# EAGLE design Smart ezNODE 503 guide lines (EAGLE 7.7.0)
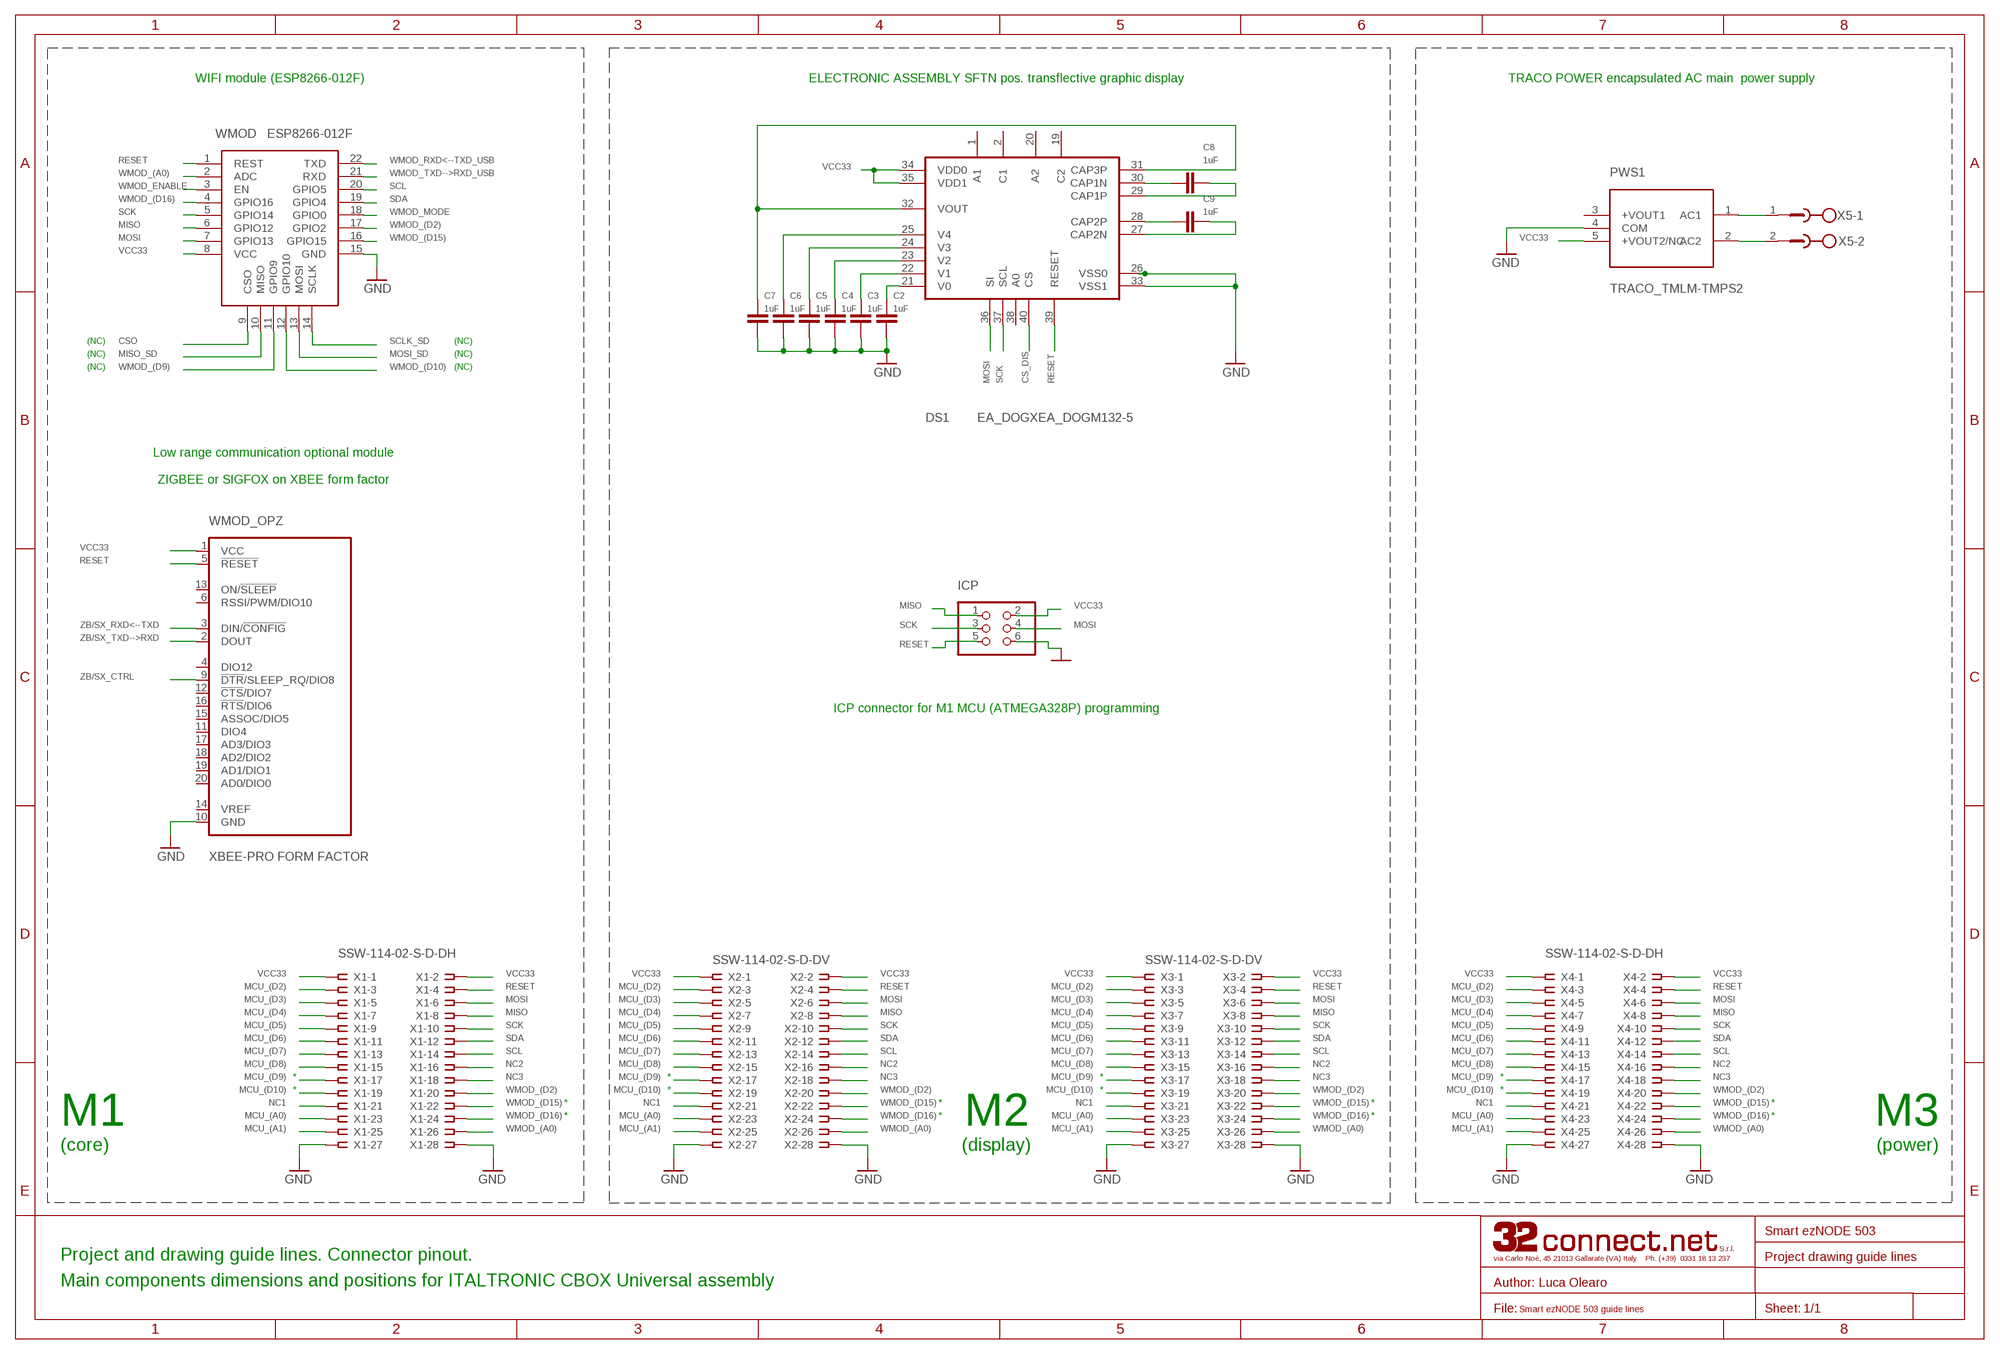
[diagram p0: schematic, sheet 1]

## Parts
C2  1uF  C-EUC0402  [C0402]
C3  1uF  C-EUC0402  [C0402]
C4  1uF  C-EUC0402  [C0402]
C5  1uF  C-EUC0402  [C0402]
C6  1uF  C-EUC0402  [C0402]
C7  1uF  C-EUC0402  [C0402]
C8  1uF  C-EUC0402  [C0402]
C9  1uF  C-EUC0402  [C0402]
DS1  EA_DOGXEA_DOGM132-5  [EA_DOGM]
ICP  PINHD-2X3/SMD  [2X3_SMD]
PWS1  TRACO_TMLM-TMPS2  [TRACO_TMPS03XXX]
WMOD  ESP8266-012F  ESP8266-12GPIO04/05_CORRECTED  [ESP8266-ESP12]
WMOD_OPZ  XBEE-PRO FORM FACTOR  XBEE-PRO  [XBEE-PRO]
X1  SSW-114-02-S-D-DH  [FTE-114-XX-G-DH]
X2  SSW-114-02-S-D-DV  [CLE-114-01-X-DV-A]
X3  SSW-114-02-S-D-DV  [CLE-114-01-X-DV-A]
X4  SSW-114-02-S-D-DH  [FTE-114-XX-G-DH]
X5  MSTBV2  [MSTBV2]

## Nets
CS_DIS: DS1.40(CS)
CSO: WMOD.9(CSO)
GND: C2.2 C3.2 C4.2 C5.2 C6.2 C7.2 DS1.26(VSS0) DS1.33(VSS1) ICP.6 PWS1.4(COM) WMOD.15(GND) WMOD_OPZ.10(GND) X1.27 X1.28 X2.27 X2.28 X3.27 X3.28 X4.27 X4.28
MCU_(A0): X1.23 X2.23 X3.23 X4.23
MCU_(A1): X1.25 X2.25 X3.25 X4.25
MCU_(D2): X1.3 X2.3 X3.3 X4.3
MCU_(D3): X1.5 X2.5 X3.5 X4.5
MCU_(D4): X1.7 X2.7 X3.7 X4.7
MCU_(D5): X1.9 X2.9 X3.9 X4.9
MCU_(D6): X1.11 X2.11 X3.11 X4.11
MCU_(D7): X1.13 X2.13 X3.13 X4.13
MCU_(D8): X1.15 X2.15 X3.15 X4.15
MCU_(D9): X1.17 X2.17 X3.17 X4.17
MCU_(D10): X1.19 X2.19 X3.19 X4.19
MISO: ICP.1 WMOD.6(GPIO12) X1.8 X2.8 X3.8 X4.8
MISO_SD: WMOD.10(MISO)
MOSI: DS1.36(SI) ICP.4 WMOD.7(GPIO13) X1.6 X2.6 X3.6 X4.6
MOSI_SD: WMOD.13(MOSI)
N$1: PWS1.1(AC1) X5.1
N$2: PWS1.2(AC2) X5.2
N$8: C2.1 DS1.21(V0)
N$9: C8.1 DS1.30(CAP1N)
N$10: C3.1 DS1.22(V1)
N$11: C4.1 DS1.23(V2)
N$12: C5.1 DS1.24(V3)
N$13: C6.1 DS1.25(V4)
N$14: C7.1 DS1.31(CAP3P) DS1.32(VOUT)
N$15: C8.2 DS1.29(CAP1P)
N$16: C9.1 DS1.28(CAP2P)
N$17: C9.2 DS1.27(CAP2N)
NC1: X1.21 X2.21 X3.21 X4.21
NC2: X1.16 X2.16 X3.16 X4.16
NC3: X1.18 X2.18 X3.18 X4.18
RESET: DS1.39(RESET) ICP.5 WMOD.1(REST) WMOD_OPZ.5(!RESET) X1.4 X2.4 X3.4 X4.4
SCK: DS1.37(SCL) ICP.3 WMOD.5(GPIO14) X1.10 X2.10 X3.10 X4.10
SCL: WMOD.20(GPIO5) X1.14 X2.14 X3.14 X4.14
SCLK_SD: WMOD.14(SCLK)
SDA: WMOD.19(GPIO4) X1.12 X2.12 X3.12 X4.12
VCC33: DS1.34(VDD0) DS1.35(VDD1) ICP.2 WMOD.8(VCC) WMOD_OPZ.1(VCC) X1.1 X1.2 X2.1 X2.2 X3.1 X3.2 X4.1 X4.2
WMOD_(A0): WMOD.2(ADC) X1.26 X2.26 X3.26 X4.26
WMOD_(D2): WMOD.17(GPIO2) X1.20 X2.20 X3.20 X4.20
WMOD_(D9): WMOD.11(GPIO9)
WMOD_(D10): WMOD.12(GPIO10)
WMOD_(D15): WMOD.16(GPIO15) X1.22 X2.22 X3.22 X4.22
WMOD_(D16): WMOD.4(GPIO16) X1.24 X2.24 X3.24 X4.24
WMOD_ENABLE: WMOD.3(EN)
WMOD_MODE: WMOD.18(GPIO0)
WMOD_RXD<--TXD_USB: WMOD.22(TXD)
WMOD_TXD-->RXD_USB: WMOD.21(RXD)
ZB/SX_RXD<--TXD: WMOD_OPZ.3(DIN/!CONFIG)
ZB/SX_TXD-->RXD: WMOD_OPZ.2(DOUT)
Unconnected: DS1.1(A1) DS1.2(C1) DS1.19(C2) DS1.20(A2) DS1.38(A0) PWS1.3(+VOUT1) PWS1.5(+VOUT2/NC) WMOD_OPZ.4(DIO12) WMOD_OPZ.6(RSSI/PWM/DIO10) WMOD_OPZ.9(!DTR!/SLEEP_RQ/DIO8) WMOD_OPZ.11(DIO4) WMOD_OPZ.12(!CTS!/DIO7) WMOD_OPZ.13(ON/!SLEEP) WMOD_OPZ.14(VREF) WMOD_OPZ.15(ASSOC/DIO5) WMOD_OPZ.16(!RTS!/DIO6) WMOD_OPZ.17(AD3/DIO3) WMOD_OPZ.18(AD2/DIO2) WMOD_OPZ.19(AD1/DIO1) WMOD_OPZ.20(AD0/DIO0)

## Notes on the sheet
- WIFI module (ESP8266-012F) | ELECTRONIC ASSEMBLY SFTN pos. transflective graphic display | TRACO POWER encapsulated AC main  power supply
- (NC) | (NC)
- (NC) | (NC)
- (NC) | (NC)
- Low range communication optional module
  
  ZIGBEE or SIGFOX on XBEE form factor
- ICP connector for M1 MCU (ATMEGA328P) programming
- * | * | * | *
- M1 | * | * | M2 | * | * | M3
- * | * | * | *
- * | * | * | *
- (core) | (display) | (power)
- Smart ezNODE 503
- Project and drawing guide lines. Connector pinout. | Project drawing guide lines
- Main components dimensions and positions for ITALTRONIC CBOX Universal assembly

## Library data of the parts
C2-C9 = rcl:C-EU: CAPACITOR, European symbol
DS1 = ea:EA_DOGX
ICP = Multiconnect_base:PINHD-2X3: PIN HEADER
PWS1 = Multiconnect_base:TRACO_TMLM-TMPS
WMOD = ESP8266 EAGLE LIBRARY:ESP8266-12: Espressif ESP8266 ESP-12 Module with GPIO04 and GPIO05 corrected.
WMOD_OPZ = Multiconnect_base:XBEE: XBee (TM) /XBee-PRO(TM) OEM RF Modules Source: MaxStream, Inc. xbee_productmanual.pdf; MPN: XBP24-AWI-001; OC_FARNELL: 1337916; OC_NEWARK: 42M2667
X1-X4 = con-samtec:SSW-114-02-S-D: THROUGH-HOLE .025" SQ POST SOCKET Source: Samtec SSW.pdf
X5 = con-phoenix-500:MSTBV2: PHOENIX; OC_FARNELL: unknown; OC_NEWARK: unknown

## Net classes
0 default: width 0.152 mm, clearance 0.152 mm
1 VCC1: width 0.152 mm, clearance 0.152 mm

## Board
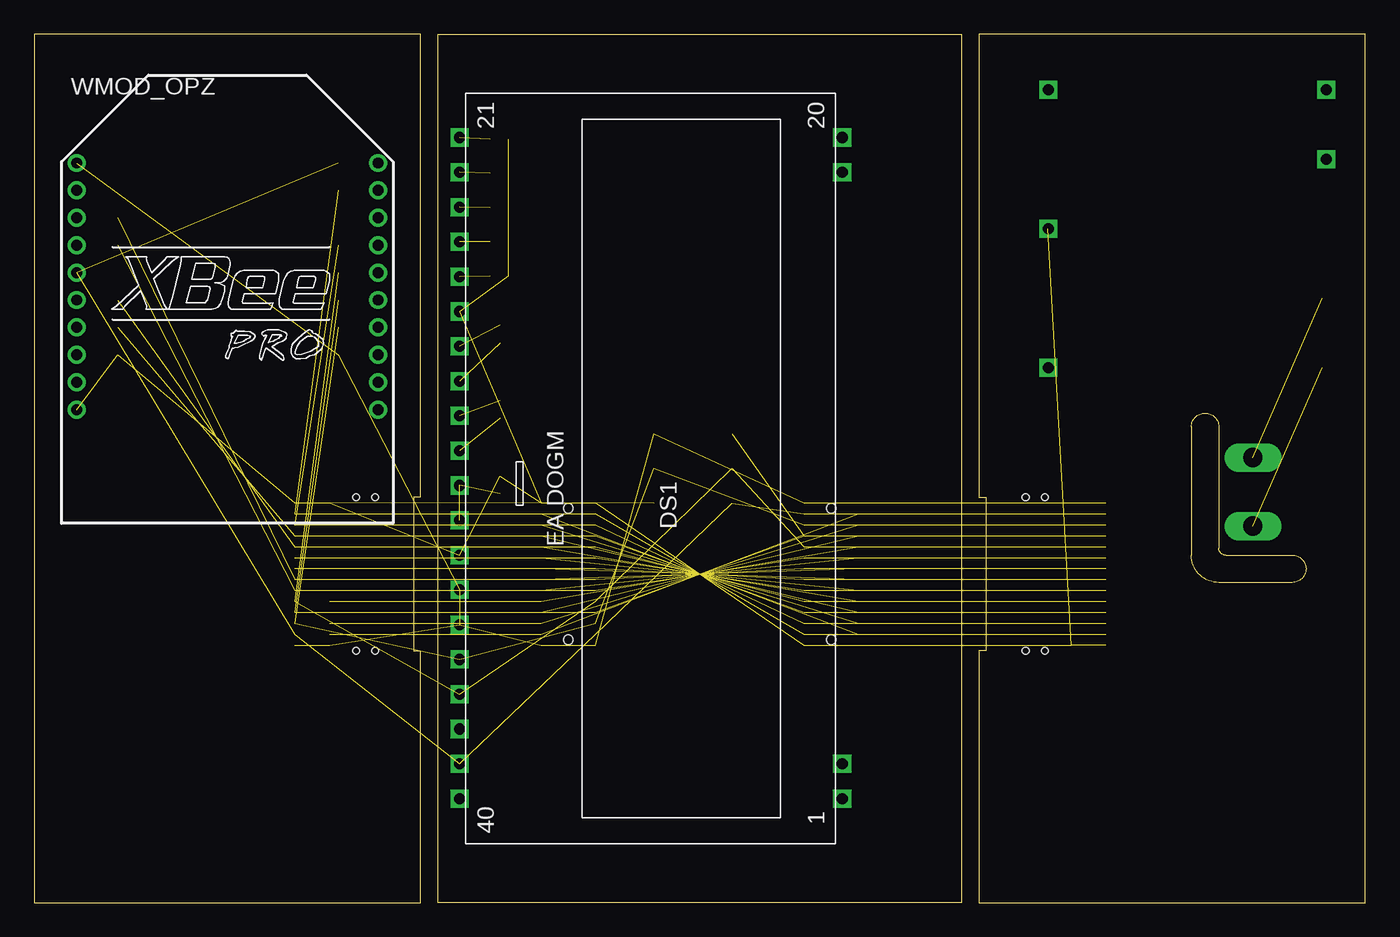
[diagram p1: board, top side]
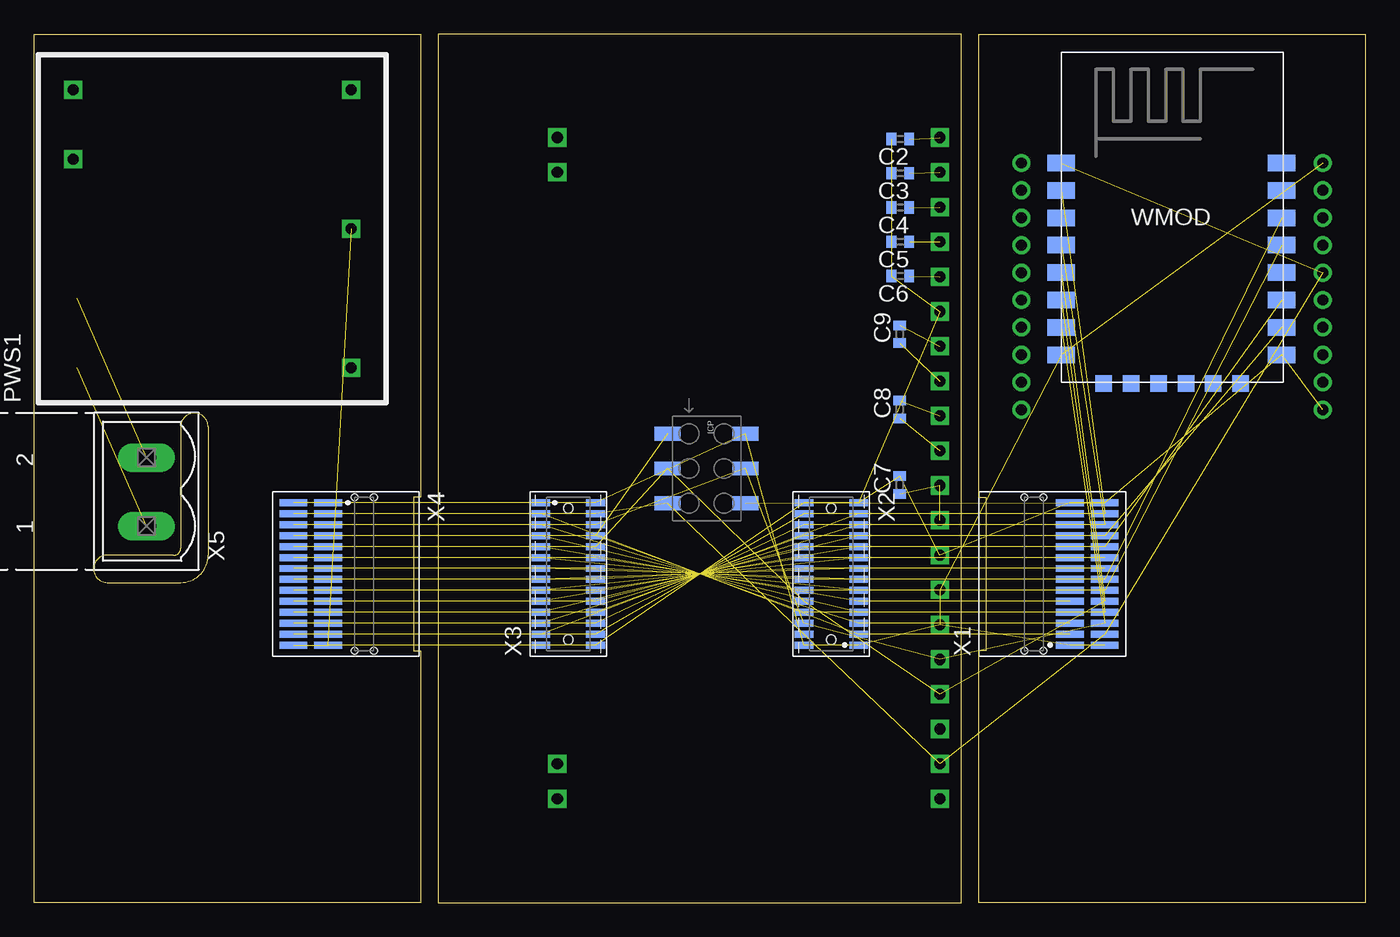
[diagram p2: board, bottom side, seen from below]

Size 97.2 x 63.4 mm. Coordinates in mm from the lower left corner, seen from the top.
Outline: 28.2,0 28.2,18.4 27.7,18.4 27.7,29.6 28.2,29.6 28.2,63.4 0,63.4 0,0 28.2,0
Outline: 67.7,0 29.5,0 29.5,63.4 67.7,63.4 67.7,0
Outline: 97.2,0 97.2,63.4 69,63.4 69,29.6 69.5,29.6 69.5,18.4 69,18.4 69,0 97.2,0
Outline: 84.5,34.75 arc-180 86.5,34.75 86.5,25.88 arc90 87,25.38 91.88,25.38 arc-180 91.88,23.38 86.5,23.38 arc-90 84.5,25.38 84.5,34.75
Copper layers (1*16): Top 0.035mm / dielectric 1.5mm / Bottom 0.035mm
Design rules "default": minimum track width 10mil, minimum drill 24mil, track to track 8mil, track to pad 8mil, pad to pad 8mil, via to via 8mil, smd to smd 8mil, copper to edge 40mil, drill to drill 8mil, minimum pad ring 10mil, minimum via ring 8mil, stop-mask expansion 4mil, vias tented up to drill 0mil, thermal gap 10mil
Holes 0.5 mm at 23.5,29.6 24.9,29.6 23.5,18.4 24.9,18.4 72.4,29.6 73.8,29.6 72.4,18.4 73.8,18.4
tKeepout: area 0,62.2 to 13.2,63.4; area 0,0 to 13.2,1.2; area 29.5,0 to 67.7,1.2; area 29.5,62.2 to 67.7,63.4; area 84,62.2 to 97.2,63.4; area 84,0 to 97.2,1.2
bKeepout: area 0,62.2 to 13.2,63.4; area 0,0 to 13.2,1.2; area 29.5,0 to 67.7,1.2; area 29.5,62.2 to 67.7,63.4; area 84,62.2 to 97.2,63.4; area 84,0 to 97.2,1.2

### Footprints (pad centres in the part's own frame; a part is rotated, then mirrored left to right if it is on the bottom)
C0402 = smd 0.7 x 0.9: 1 -0.65,0; 2 0.65,0
EA_DOGM = drill 0.813 square: 1 0,0; 2 2.54,0; 19 45.72,0; 20 48.26,0; 21 48.26,27.94; 22 45.72,27.94; 23 43.18,27.94; 24 40.64,27.94; 25 38.1,27.94; 26 35.56,27.94; 27 33.02,27.94; 28 30.48,27.94; 29 27.94,27.94; 30 25.4,27.94; 31 22.86,27.94; 32 20.32,27.94; 33 17.78,27.94; 34 15.24,27.94; 35 12.7,27.94; 36 10.16,27.94; 37 7.62,27.94; 38 5.08,27.94; 39 2.54,27.94; 40 0,27.94
2X3_SMD = smd 1.02 x 1.9: 1 -2.54,-2.85; 2 -2.54,2.85; 3 0,-2.85; 4 0,2.85; 5 2.54,-2.85; 6 2.54,2.85
TRACO_TMPS03XXX = drill 0.8 square: 1 17.78,22.86; 2 22.86,22.86; 3 2.54,2.56; 4 12.7,2.56; 5 22.86,2.56
ESP8266-ESP12 = smd 2 x 1.2: 1 0,16; 2 0,14; 3 0,12; 4 0,10; 5 0,8; 6 0,6; 7 0,4; 8 0,2; 15 16.1,2; 16 16.1,4; 17 16.1,6; 18 16.1,8; 19 16.1,10; 20 16.1,12; 21 16.1,14; 22 16.1,16 | smd 1.2 x 1.2: 9 3.1,-0.1; 10 5.1,-0.1; 11 7.1,-0.1; 12 9.1,-0.1; 13 11.1,-0.1; 14 13.1,-0.1
XBEE-PRO = drill 0.8 pad 1.27: 1 -11,9; 2 -11,7; 3 -11,5; 4 -11,3; 5 -11,1; 6 -11,-1; 7 -11,-3; 8 -11,-5; 9 -11,-7; 10 -11,-9; 11 11,-9; 12 11,-7; 13 11,-5; 14 11,-3; 15 11,-1; 16 11,1; 17 11,3; 18 11,5; 19 11,7; 20 11,9
FTE-114-XX-G-DH = smd 0.508 x 2.032: 1 -5.2,1.27; 2 -5.2,-1.27; 3 -4.4,1.27; 4 -4.4,-1.27; 5 -3.6,1.27; 6 -3.6,-1.27; 7 -2.8,1.27; 8 -2.8,-1.27; 9 -2,1.27; 10 -2,-1.27; 11 -1.2,1.27; 12 -1.2,-1.27; 13 -0.4,1.27; 14 -0.4,-1.27; 15 0.4,1.27; 16 0.4,-1.27; 17 1.2,1.27; 18 1.2,-1.27; 19 2,1.27; 20 2,-1.27; 21 2.8,1.27; 22 2.8,-1.27; 23 3.6,1.27; 24 3.6,-1.27; 25 4.4,1.27; 26 4.4,-1.27; 27 5.2,1.27; 28 5.2,-1.27
CLE-114-01-X-DV-A = smd 0.508 x 1.372: 1 5.2,2; 2 5.2,-2; 3 4.4,2; 4 4.4,-2; 5 3.6,2; 6 3.6,-2; 7 2.8,2; 8 2.8,-2; 9 2,2; 10 2,-2; 11 1.2,2; 12 1.2,-2; 13 0.4,2; 14 0.4,-2; 15 -0.4,2; 16 -0.4,-2; 17 -1.2,2; 18 -1.2,-2; 19 -2,2; 20 -2,-2; 21 -2.8,2; 22 -2.8,-2; 23 -3.6,2; 24 -3.6,-2; 25 -4.4,2; 26 -4.4,-2; 27 -5.2,2; 28 -5.2,-2 | hole 0.686: -4.8,0; 4.8,0
MSTBV2 = drill 1.397 long: 1 -2.5,0; 2 2.5,0

### Placement (x,y rotation side)
C2  33.95,55.75 180 bottom
C3  33.95,53.25 180 bottom
C4  33.95,50.75 180 bottom
C5  33.95,48.25 180 bottom
C6  33.95,45.75 180 bottom
C7  34,30.5 90 bottom
C8  34,36 90 bottom
C9  34,41.5 90 bottom
DS1  59,7.6 90 top
ICP  48.1,31.7 270 bottom
PWS1  71.5,36.5 90 bottom
WMOD  22.2,38 0 bottom
WMOD_OPZ  14.1,45 0 top
X1  20.3,24 90 bottom
X2  39,24 270 bottom
X3  58.2,24 90 bottom
X4  77,24 270 bottom
X5  89,30 90 bottom

### Tracks (layer width: path | path; a pad name or v marks a point on that pad's centre or on a via)
GND  (19 unrouted)
MCU_(A0)  (3 unrouted)
MCU_(A1)  (3 unrouted)
MCU_(D2)  (3 unrouted)
MCU_(D3)  (3 unrouted)
MCU_(D4)  (3 unrouted)
MCU_(D5)  (3 unrouted)
MCU_(D6)  (3 unrouted)
MCU_(D7)  (3 unrouted)
MCU_(D8)  (3 unrouted)
MCU_(D9)  (3 unrouted)
MCU_(D10)  (3 unrouted)
MISO  (5 unrouted)
MOSI  (6 unrouted)
N$1  (1 unrouted)
N$2  (1 unrouted)
N$3
  cutout Bottom: 85.5,62.5 97,62.5 97,24.38 85.5,24.38
N$6
  cutout Top (no thermals): 85.5,24.38 85.5,62.5 97,62.5 97,24.38
N$8  (1 unrouted)
N$9  (1 unrouted)
N$10  (1 unrouted)
N$11  (1 unrouted)
N$12  (1 unrouted)
N$13  (1 unrouted)
N$14  (2 unrouted)
N$15  (1 unrouted)
N$16  (1 unrouted)
N$17  (1 unrouted)
NC1  (3 unrouted)
NC2  (3 unrouted)
NC3  (3 unrouted)
RESET  (7 unrouted)
SCK  (6 unrouted)
SCL  (4 unrouted)
SDA  (4 unrouted)
VCC33  (12 unrouted)
WMOD_(A0)  (4 unrouted)
WMOD_(D2)  (4 unrouted)
WMOD_(D15)  (4 unrouted)
WMOD_(D16)  (4 unrouted)

### Text on the board
Notes: M1 | (core) | M2 | (display) | M3 | (power)